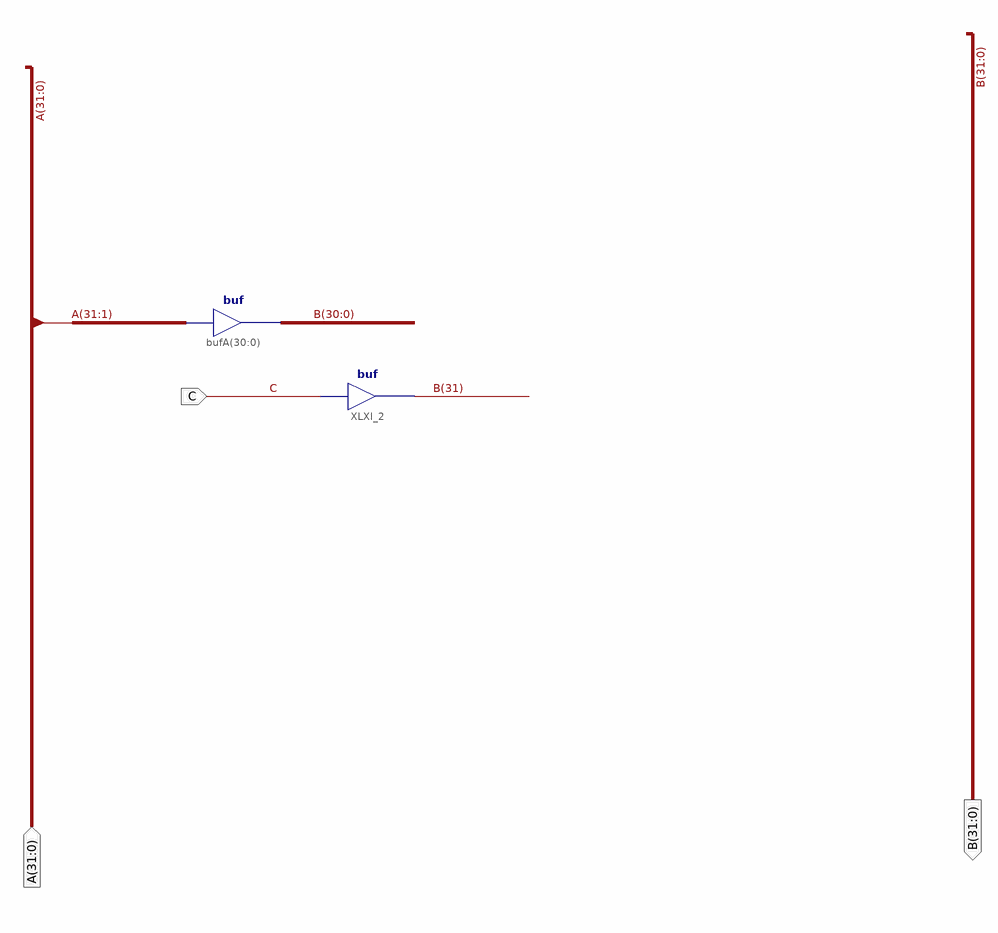
[diagram p0: schematic sheet 1]
// Xilinx ISE schematic shift_1bit.sch (artix7) as structural Verilog: 2 symbols, 3 ports
module shift_1bit (
  input  [31:0] A,
  input  C,
  output [31:0] B
);

  buf XLXI_2 (B[31], C);
  assign B[30:0] = A[31:1];  // buf bufA[30..0], 31 bits wide
endmodule
